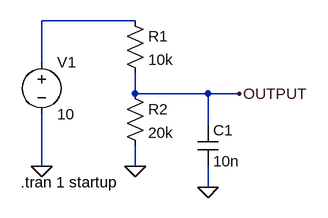
[diagram p0: schematic Draft 1.asc]
Draft 1.asc, the LTspice schematic file:
Version 4
SHEET 1 880 680
WIRE 176 64 32 64
WIRE 32 128 32 64
WIRE 176 176 176 144
WIRE 288 176 176 176
WIRE 336 176 288 176
WIRE 288 224 288 176
WIRE 32 288 32 208
WIRE 176 288 176 256
WIRE 288 320 288 288
FLAG 32 288 0
FLAG 176 288 0
FLAG 336 176 OUTPUT
FLAG 288 320 0
SYMBOL res 160 48 R0
SYMATTR InstName R1
SYMATTR Value 10k
SYMBOL res 160 160 R0
SYMATTR InstName R2
SYMATTR Value 20k
SYMBOL voltage 32 112 R0
WINDOW 123 0 0 Left 0
WINDOW 39 0 0 Left 0
SYMATTR InstName V1
SYMATTR Value 10
SYMBOL cap 272 224 R0
SYMATTR InstName C1
SYMATTR Value 10n
TEXT 0 312 Left 2 !.tran 1 startup

The netlist it stands for:
* Draft 1.asc
R1 N001 OUTPUT 10k
R2 OUTPUT 0 20k
V1 N001 0 10
C1 OUTPUT 0 10n
.tran 1 startup
.backanno
.end

* Results of the author's LTspice run, read from the files saved beside the schematic
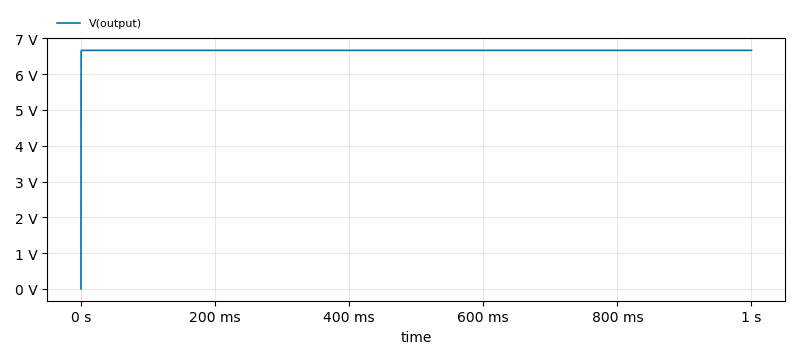
[diagram p1: Transient Analysis of Draft 1.asc, plotted from the saved traces]
* Transient Analysis, 1 run:
*   V(output): min 0 V, max 6.667 V, average 6.666 V, rms 6.666 V, last 6.667 V